# EAGLE design amp-LO-TSY-1XXLNB+ (EAGLE 9.2.2)
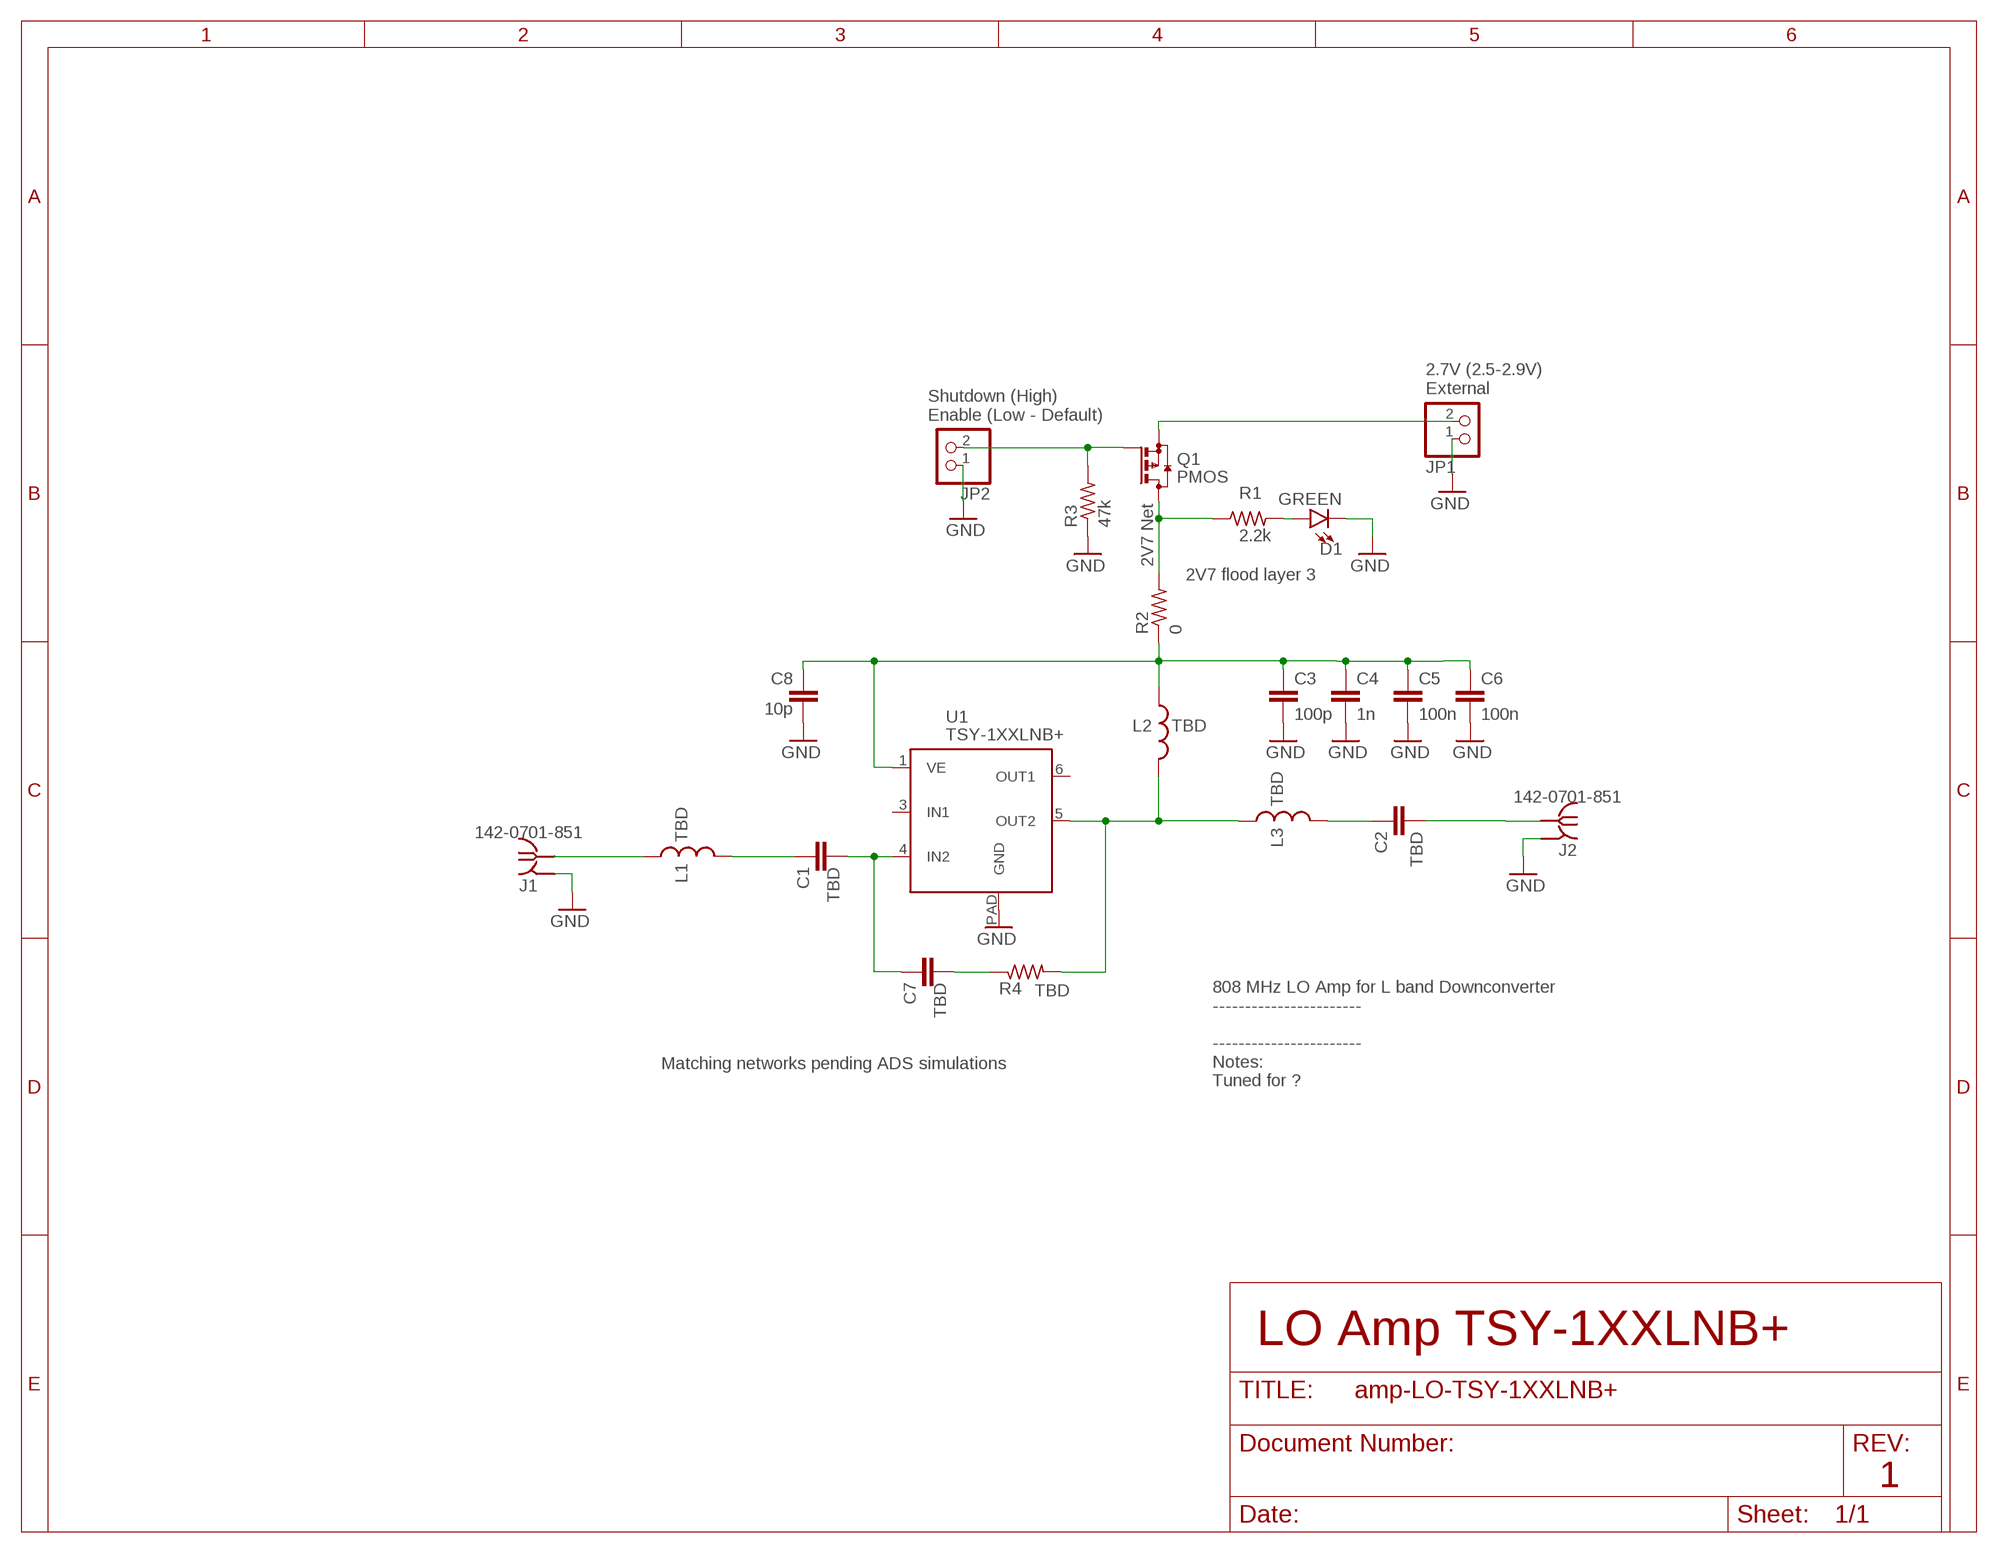
[diagram p0: schematic, sheet 1]

## Parts
C1  TBD  C-EU0402-C-NOSILK  [.0402-C-NOSILK]
C2  TBD  C-EU0402-C-NOSILK  [.0402-C-NOSILK]
C3  100p  C-EU0603-B-NOSILK  [.0603-B-NOSILK]
C4  1n  C-EU0603-B-NOSILK  [.0603-B-NOSILK]
C5  100n  C-EU0603-B-NOSILK  [.0603-B-NOSILK]
C6  100n  C-EU0603-B-NOSILK  [.0603-B-NOSILK]
C7  TBD  C-EU0402-C-NOSILK  [.0402-C-NOSILK]
C8  10p  C-EU0402-C-NOSILK  [.0402-C-NOSILK]
D1  GREEN  LED-GREEN0603  [LED-0603]
J1  142-0701-851  [142-0701-851]
J2  142-0701-851  [142-0701-851]
JP1  PINHD-1X2  [1X02]
JP2  PINHD-1X2  [1X02]
L1  TBD  L-US0402-C-NOSILK  [.0402-C-NOSILK]
L2  TBD  L-US0603-C-NOSILK  [.0603-C-NOSILK]
L3  TBD  L-US0402-C-NOSILK  [.0402-C-NOSILK]
Q1  PMOS  BSS84  [SOT23]
R1  2.2k  R-US_0603-B-NOSILK  [.0603-B-NOSILK]
R2  0  R-US_0603-B-NOSILK  [.0603-B-NOSILK]
R3  47k  R-US_0402-B-NOSILK  [.0402-B-NOSILK]
R4  TBD  R-US_0402-B-NOSILK  [.0402-B-NOSILK]
U1  TSY-1XXLNB+  [MCLP8-2X2-WITH-PAD]

## Nets
2V7: Q1.3(D) R1.1 R2.2
GND: C3.2 C4.2 C5.2 C6.2 C8.2 D1.C J1.GND1(GND) J1.GND2(GND) J1.GND3(GND) J1.GND4(GND) J2.GND1(GND) J2.GND2(GND) J2.GND3(GND) J2.GND4(GND) JP1.1 JP2.1 R3.1 U1.PAD(GND)
IN: C1.2 C7.1 U1.4(IN2)
N$1: JP2.2 Q1.1(G) R3.2
N$5: C2.1 L3.2
N$6: C1.1 L1.2
N$9: C7.2 R4.1
N$10: D1.A R1.2
N$11: J1.RF1(RF) L1.1
OUT: L2.2 L3.1 R4.2 U1.5(OUT2)
RF_OUT: C2.2 J2.RF1(RF)
VE: C3.1 C4.1 C5.1 C6.1 C8.1 L2.1 R2.1 U1.1(VE)
VEXT: JP1.2 Q1.2(S)
Unconnected: U1.3(IN1) U1.6(OUT1)

## Notes on the sheet
- 2.7V (2.5-2.9V)
  External
- Shutdown (High)
  Enable (Low - Default)
- 2V7 Net
- 2V7 flood layer 3
- 808 MHz LO Amp for L band Downconverter
  -----------------------
  
  -----------------------
  Notes:
  Tuned for ?
- Matching networks pending ADS simulations
- LO Amp TSY-1XXLNB+
- 1

## Library data of the parts
C1-C8 = oresat-rcl:C-EU: CAPACITOR, European symbol
D1 = SparkFun-LED:LED-GREEN: Green SMD LED Used in manufacturing of various products at SparkFun Packages: 0603 - SMD 0603 package [Product Link] <http://www.futureelectronics.com/en/technologies/semiconductors/optoelectronics/leds/Pages/9894312-LTST-C190GKT.aspx?CrossPart=HSMG-C190&IM=0> LilyPad 1206 - SMD1206 LilyPad package [Product Link] <http://www.futureelectronics.com/en/Technologies/Product.aspx?ProductID=IN150NGHARVATEKCORPORATION2049943&IM=0> 1206 - SMD1206 package [Product Link] <http://www.futureelectronics.com/en/technologies/semiconductors/optoelectronics/leds/Pages/8315665-LTST-C150KGKT.aspx?IM=0> 1206 Bottom Mount -SMD 1206 Bottom Mount [Product Link] <http://www.digikey.com/product-detail/en/lite-on-inc/LTST-C230KGKT/160-1456-1-ND/386854> SparkFun Products: Pro Mini 328 -5V <https://www.sparkfun.com/products/821> RedBoard <https://www.sparkfun.com/products/12757> MP3 Trigger <https://www.sparkfun.com/products/13720> Makey Makey <https://www.sparkfun.com/products/11076>
J1 J2 = J-Cinch-142-0701-851-SMA-end-launch:142-0701-851: SMA Jack 50Ω - End Launch Source: Datasheet <https://belfuse.com/resources/productinformations/cinchconnectivitysolutions/johnson/pi-ccs-john-142-0701-851.pdf>
JP1 JP2 = pinhead:PINHD-1X2: PIN HEADER
L1-L3 = oresat-rcl:L-US: INDUCTOR, American symbol
Q1 = transistor-small-signal:BSS84: P-CHANNEL MOS FET
R1-R4 = oresat-rcl:R-US_: RESISTOR, American symbol
U1 = U-MiniCirc-TSY-1XXLNB+-amp:TSY-1XXLNB+: Low Power, Low Noise, MMIC Amplifier TSY-13LNB+: 0.03 - 1.0 GHz Operational Bandwidth Source: Datasheet <https://www.minicircuits.com/WebStore/dashboard.html?model=TSY-13LNB%2B> TSY-172LNB+: 0.03 - 1.7 GHz Operational Bandwidth Source: Datasheet <https://www.minicircuits.com/WebStore/dashboard.html?model=TSY-172LNB%2B>

## Net classes
1 RF1: clearance 0.5 mm
2 RF2: clearance 0.8 mm

## Board
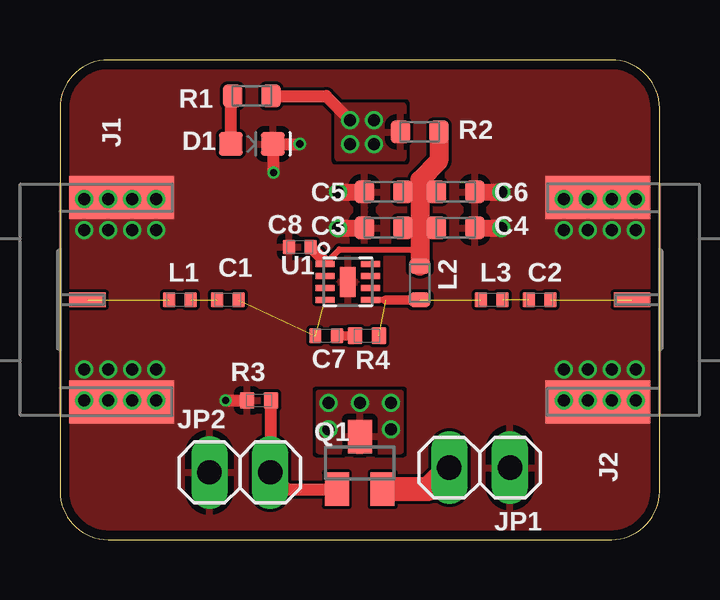
[diagram p1: board, top side]
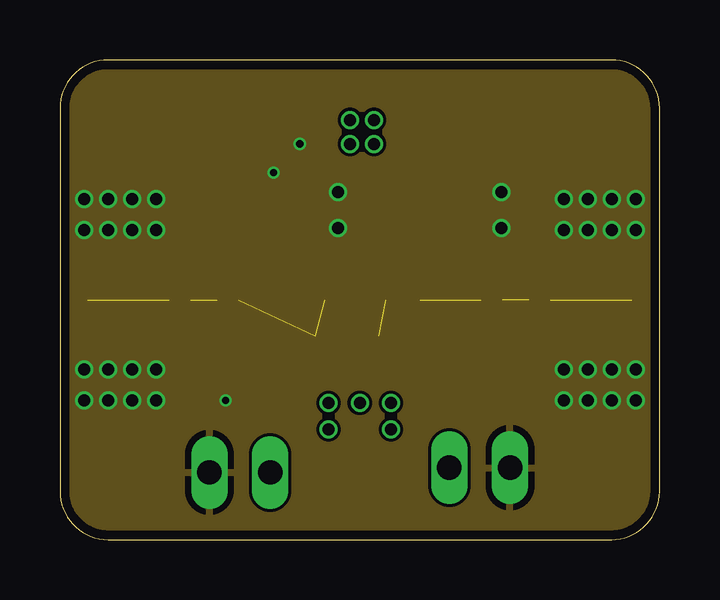
[diagram p2: board, inner layer Route2]
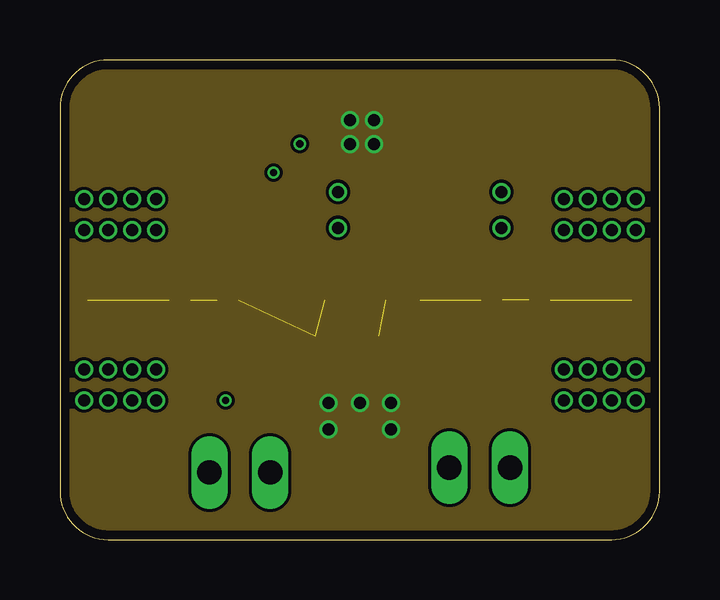
[diagram p3: board, inner layer Route15]
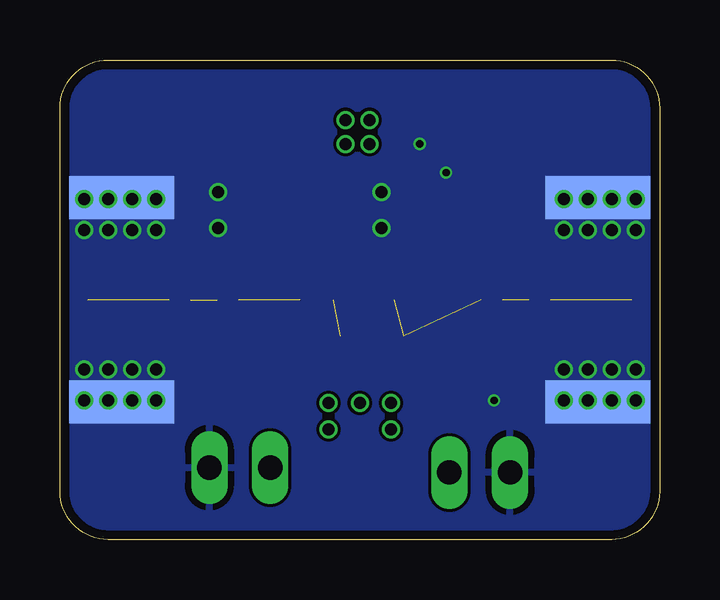
[diagram p4: board, bottom side, seen from below]

Size 25 x 20 mm. Coordinates in mm from the lower left corner, seen from the top.
Outline: 25,2 25,18 arc90 23,20 2,20 arc90 0,18 0,2 arc90 2,0 23,0 arc90 25,2
Copper layers (1*2*15*16): Top 0.035559375mm / dielectric 0.17018125mm / Route2 0.01778125mm / dielectric 47mil / Route15 0.01778125mm / dielectric 0.17018125mm / Bottom 0.035559375mm
Design rules "oshpark-4layer-tented": minimum track width 5mil, minimum drill 10mil, track to track 5mil, track to pad 5mil, pad to pad 5mil, via to via 5mil, smd to smd 5mil, copper to edge 15mil, drill to drill 6mil, minimum pad ring 4mil, minimum via ring 4mil, stop-mask expansion 2.5mil, vias tented up to drill 20mil, thermal gap 10mil

### Footprints (pad centres in the part's own frame; a part is rotated, then mirrored left to right if it is on the bottom)
.0402-C-NOSILK = smd 0.5 x 0.6: 1 -0.45,0; 2 0.45,0
.0603-B-NOSILK = smd 0.8 x 0.95: 1 -0.8,0; 2 0.8,0
LED-0603 = smd 1 x 1: A -0.877,0; C 0.877,0
142-0701-851 = smd 1.8 x 4.37: GND1 -4.255,-2.566; GND2 4.255,-2.566 | smd 1.8 x 4.37 bottom: GND3 -4.255,-2.566; GND4 4.255,-2.566 | smd 0.6 x 1.53: RF1 0,-1.146
1X02 = drill 1.016 long: 1 -1.27,0; 2 1.27,0
.0603-C-NOSILK = smd 0.6 x 0.9: 1 -0.7,0; 2 0.7,0
SOT23 = smd 1 x 1.4: 1 -0.95,-1.1; 2 0.95,-1.1; 3 0,1.1
.0402-B-NOSILK = smd 0.6 x 0.7: 1 -0.5,0; 2 0.5,0
MCLP8-2X2-WITH-PAD = smd 0.25 x 0.8: 1 -0.75,-0.95; 2 -0.25,-0.95; 3 0.25,-0.95; 4 0.75,-0.95; 5 0.75,0.95; 6 0.25,0.95; 7 -0.25,0.95; 8 -0.75,0.95 | smd 1.25 x 0.65: PAD 0,0

### Placement (x,y rotation side)
C1  7,10 0 top
C2  20,10 0 top
C3  13.5,13 180 top
C4  16.5,13 0 top
C5  13.5,14.5 180 top
C6  16.5,14.5 0 top
C7  11.1,8.5 0 top
C8  10,12.2 180 top
D1  8,16.5 0 top
J1  0,10 90 top
J2  25,10 270 top
JP1  17.5,3 180 top
JP2  7.5,2.8 0 top
L1  5,10 0 top
L2  15,10.7 270 top
L3  18,10 0 top
Q1  12.5,3.2 0 top
R1  8,18.5 180 top
R2  15,17 180 top
R3  8.3,5.8 0 top
R4  12.8,8.5 0 top
U1  12,10.75 270 top

### Tracks (layer width: path | path; a pad name or v marks a point on that pad's centre or on a via)
2V7  (via drill 0.5)
  Top 0.5: R1.1 11.1,18.5 v12.1,17.5
  other vias: 12.5,5.7 13.8,5.7 13.8,4.6 11.2,4.6 11.2,5.7 12.1,16.5 13.1,16.5 13.1,17.5
  pour Route15: 0,20 0,0 25,0 25,20
  pour Top: 10.8,6.1 10.8,3.7 14.2,3.7 14.2,6.1
  pour Top: 14.3,15.9 11.6,15.9 11.6,18.1 14.3,18.1
GND  (via drill 0.3, 0.5)
  Top 0.5: v8.9,15.3 8.9,16.48 D1.C v10,16.5 | v6.9,5.8 R3.1
  Top 0.7: v11.6,13 C3.2 | v11.6,14.5 C5.2 | C6.2 v18.4,14.5 | C4.2 v18.4,13
  other vias: 21,5.8 22,5.8 23,5.8 24,5.8 24,7.1 23,7.1 22,7.1 21,7.1 21,12.9 22,12.9 23,12.9 24,12.9 24,14.2 23,14.2 22,14.2 21,14.2 1,14.2 2,14.2 3,14.2 4,14.2 1,12.9 2,12.9 3,12.9 4,12.9 1,5.8 2,5.8 3,5.8 4,5.8 1,7.1 2,7.1 3,7.1 4,7.1
  pour Top (rank 2): 0,20 0,0 25,0 25,20
  pour Bottom: 0,20 0,0 25,0 25,20
  pour Route2: 0,20 0,0 25,0 25,20
  pour Top (no thermals): 0,16 5,16 5,4 0,4
  pour Top (no thermals): 20,16 25,16 25,4 20,4
  pour Bottom (no thermals): 0,16 5,16 5,4 0,4
  pour Bottom (no thermals): 20,16 25,16 25,4 20,4
IN  (2 unrouted)
N$1
  Top 0.5: Q1.1 9.47,2.1 JP2.2 8.8,2.83 R3.2
N$5  (1 unrouted)
N$6  (1 unrouted)
N$9
  Top 0.39: C7.2 R4.1
N$10
  Top 0.5: R1.2 7.12,18.42 D1.A
N$11  (1 unrouted)
OUT  (2 unrouted)
  Top 0.25: 13.6,10 U1.5
  Top 0.39: L2.2 13.6,10
RF_OUT  (1 unrouted)
VE
  Top 0.25: U1.1 11.18,11.62 11.65,12.1 15,12.1
  Top 0.3: 11.03,11.62 11.18,11.62
  Top 0.5: C8.1 11.03,11.62
  Top 0.8: R2.1 15.8,15.8 15,15 15,14.5 | 15,14.5 15,13 | 15,13 15,12.1 L2.1 | C5.1 15,14.5 | C6.1 15,14.5 | C3.1 15,13 | C4.1 15,13
VEXT
  Top 1: JP1.2 15.33,2.1 Q1.2